# EAGLE design ICSP_Pogo_Connector (EAGLE 6.1)
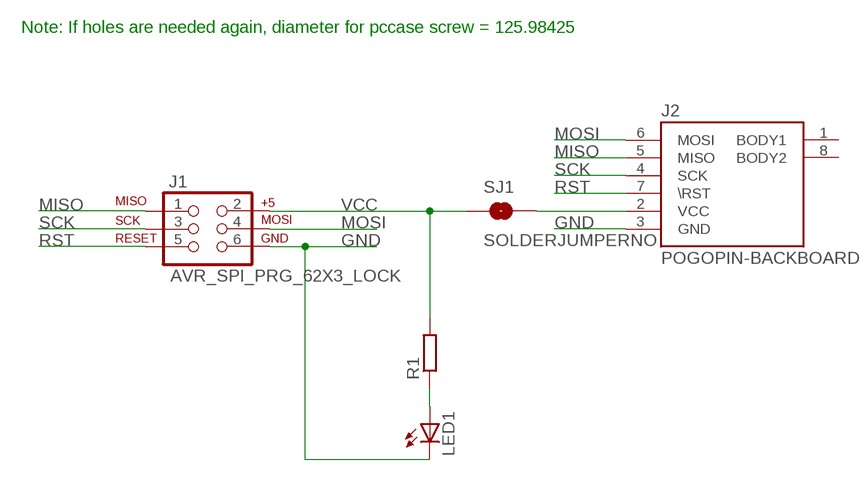
[diagram p0: schematic, sheet 1]

## Parts
J1  AVR_SPI_PRG_62X3_LOCK  [2X3_LOCK]
J2  POGOPIN-BACKBOARD  [POGOPROG-BACKMOUNT]
LED1  LEDCHIP-LED0805  [CHIP-LED0805]
R1  R-EU_M0805  [M0805]
SJ1  SOLDERJUMPERNO  [SJ_2S-NO]

## Nets
GND [POWER]: J1.6 J2.3(GND) LED1.C
MISO: J1.1 J2.5(MISO)
MOSI: J1.4 J2.6(MOSI)
N$2: J2.2(VCC) SJ1.2
N$3: LED1.A R1.1
RST: J1.5 J2.7(\RST)
SCK: J1.3 J2.4(SCK)
VCC: J1.2 R1.2 SJ1.1
Unconnected: J2.1(BODY1) J2.8(BODY2)

## Notes on the sheet
- Note: If holes are needed again, diameter for pccase screw = 125.98425

## Library data of the parts
J1 = SparkFun:AVR_SPI_PRG_6: AVR ISP 6 Pin This is the reduced ISP connector for AVR programming. Common on Arduino. This footprint will take up less PCB space and can be used with a 10-pin to 6-pin adapter such as SKU: BOB-08508
J2 = Protofusion:POGOPIN-BACKBOARD
LED1 = led:LED: LED OSRAM: - CHIPLED LG R971, LG N971, LY N971, LG Q971, LY Q971, LO R971, LY R971 LH N974, LH R974 LS Q976, LO Q976, LY Q976 LO Q996 - Hyper CHIPLED LW Q18S LB Q993, LB Q99A, LB R99A - SideLED LS A670, LO A670, LY A670, LG A670, LP A670 LB A673, LV A673, LT A673, LW A673 LH A674 LY A675 LS A676, LA A676, LO A676, LY A676, LW A676 LS A679, LY A679, LG A679 - Hyper Micro SIDELED® LS Y876, LA Y876, LO Y876, LY Y876 LT Y87S - SmartLED LW L88C, LW L88S LB L89C, LB L89S, LG L890 LS L89K, LO L89K, LY L89K LS L896, LA L896, LO L896, LY L896 - TOPLED LS T670, LO T670, LY T670, LG T670, LP T670 LSG T670, LSP T670, LSY T670, LOP T670, LYG T670 LG T671, LOG T671, LSG T671 LB T673, LV T673, LT T673, LW T673 LH T674 LS T676, LA T676, LO T676, LY T676, LB T676, LH T676, LSB T676, LW T676 LB T67C, LV T67C, LT T67C, LS T67K, LO T67K, LY T67K, LW E67C LS E67B, LA E67B, LO E67B, LY E67B, LB E67C, LV E67C, LT E67C LW T67C LS T679, LY T679, LG T679 LS T770, LO T770, LY T770, LG T770, LP T770 LB T773, LV T773, LT T773, LW T773 LH T774 LS E675, LA E675, LY E675, LS T675 LS T776, LA T776, LO T776, LY T776, LB T776 LHGB T686 LT T68C, LB T68C - Hyper Mini TOPLED® LB M676 - Mini TOPLED Santana® LG M470 LS M47K, LO M47K, LY M47K Source: http://www.osram.convergy.de LUXEON: - LUMILED® LXK2-PW12-R00, LXK2-PW12-S00, LXK2-PW14-U00, LXK2-PW14-V00 LXK2-PM12-R00, LXK2-PM12-S00, LXK2-PM14-U00 LXK2-PE12-Q00, LXK2-PE12-R00, LXK2-PE12-S00, LXK2-PE14-T00, LXK2-PE14-U00 LXK2-PB12-K00, LXK2-PB12-L00, LXK2-PB12-M00, LXK2-PB14-N00, LXK2-PB14-P00, LXK2-PB14-Q00 LXK2-PR12-L00, LXK2-PR12-M00, LXK2-PR14-Q00, LXK2-PR14-R00 LXK2-PD12-Q00, LXK2-PD12-R00, LXK2-PD12-S00 LXK2-PH12-R00, LXK2-PH12-S00 LXK2-PL12-P00, LXK2-PL12-Q00, LXK2-PL12-R00 Source: www.luxeon.com KINGBRIGHT: KA-3528ASYC Source: www.kingbright.com
R1 = rcl:R-EU_: RESISTOR, European symbol
SJ1 = SparkFun:SOLDERJUMPER: Solder Jumper Standard SMD solder jumper. Used to automate production. Two varients : Normally Open and Normally Closed are the same, but have different paste layers. NC will have a large amount of paste and should jumper during reflow.

## Net classes
0 default: width 0.254 mm
1 POWER: width 0.406 mm

## Board
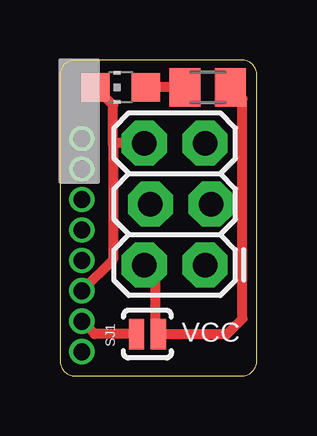
[diagram p1: board, top side]
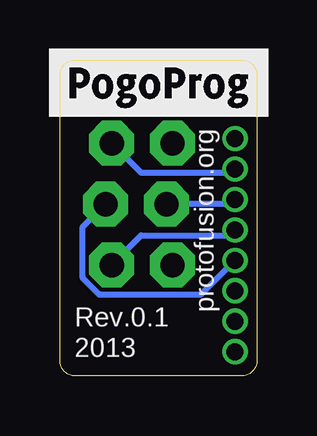
[diagram p2: board, bottom side, seen from below]

Size 8.22 x 13.18 mm. Coordinates in mm from the lower left corner, seen from the top.
Outline: 0,12.55 0,0.64 arc90 0.64,0 7.58,0 arc90 8.22,0.64 8.22,12.55 arc90 7.58,13.18 0.64,13.18 arc90 0,12.55
Copper layers (1*16): Top 0.0356mm / dielectric 1.5011mm / Bottom 0.0356mm
Design rules: minimum track width 6mil, minimum drill 6mil, track to track 6mil, track to pad 6mil, pad to pad 6mil, via to via 6mil, smd to smd 6mil, copper to edge 15mil, drill to drill 6mil, minimum pad ring 7mil, minimum via ring 7mil, stop-mask expansion 4mil, vias tented up to drill 12mil, thermal gap 10mil

### Footprints (pad centres in the part's own frame; a part is rotated, then mirrored left to right if it is on the bottom)
2X3_LOCK = drill 1.016 pad 1.88 octagon: 1 0,0; 2 0,2.54; 3 2.54,-0.254; 4 2.54,2.286; 5 5.08,0; 6 5.08,2.54
POGOPROG-BACKMOUNT = drill 0.7: 1 0,8.941; 2 0,7.671; 3 0,6.401; 4 0,5.131; 5 0,3.861; 6 0,2.591; 7 0,1.321; 8 0,0.051
CHIP-LED0805 = smd 1.2 x 1.2: A 0,-1.05; C 0,1.05
M0805 = smd 1.3 x 1.6: 1 -0.95,0; 2 0.95,0
SJ_2S-NO = smd 0.635 x 1.27: 1 -0.45,0; 2 0.45,0

### Placement (x,y rotation side)
J1  6.06,4.63 90 top
J2  0.91,9.95 180 top
LED1  2.53,12.04 90 top
R1  6.17,12.04 0 top
SJ1  3.65,1.75 180 top
U$2  [POGOPROG_LOGO]  8.66,10.82 0 bottom

### Tracks (layer width: path | path; a pad name or v marks a point on that pad's centre or on a via)
GND
  Top 0.406: J2.3 2.21,4.85 2.21,9.66 2.22,9.67 | J1.6 2.26,9.71 2.22,9.67 | 2.22,9.67 2.22,11.3 LED1.C
MISO
  Bottom 0.254: J2.5 1.14,5.86 4.83,5.86 6.04,4.64 J1.1
MOSI
  Bottom 0.254: J2.6 1.09,7.18 3.76,7.18 J1.4
N$2
  Top 0.406: SJ1.2 1.45,1.75 J2.2
N$3
  Top 0.406: R1.1 3.96,12.04 3.96,12.05 4.06,12.05 LED1.A
RST
  Bottom 0.254: J2.7 1.07,8.48 4.83,8.48 6.04,9.7 J1.5
SCK
  Bottom 0.254: J2.4 2.34,3.4 6.58,3.4 7.29,4.11 7.29,6.19 6.33,7.16 J1.3
VCC
  Top 0.254: 3.53,4.62 J1.2 | 3.99,2.08 SJ1.1
  Top 0.406: SJ1.1 6.99,1.75 7.62,2.38 7.62,11.57 R1.2 | 3.53,4.62 3.99,4.15 3.99,2.08

### Text on the board
tPlace: VCC
bPlace: protofusion.org | Rev.0.1 | 2013